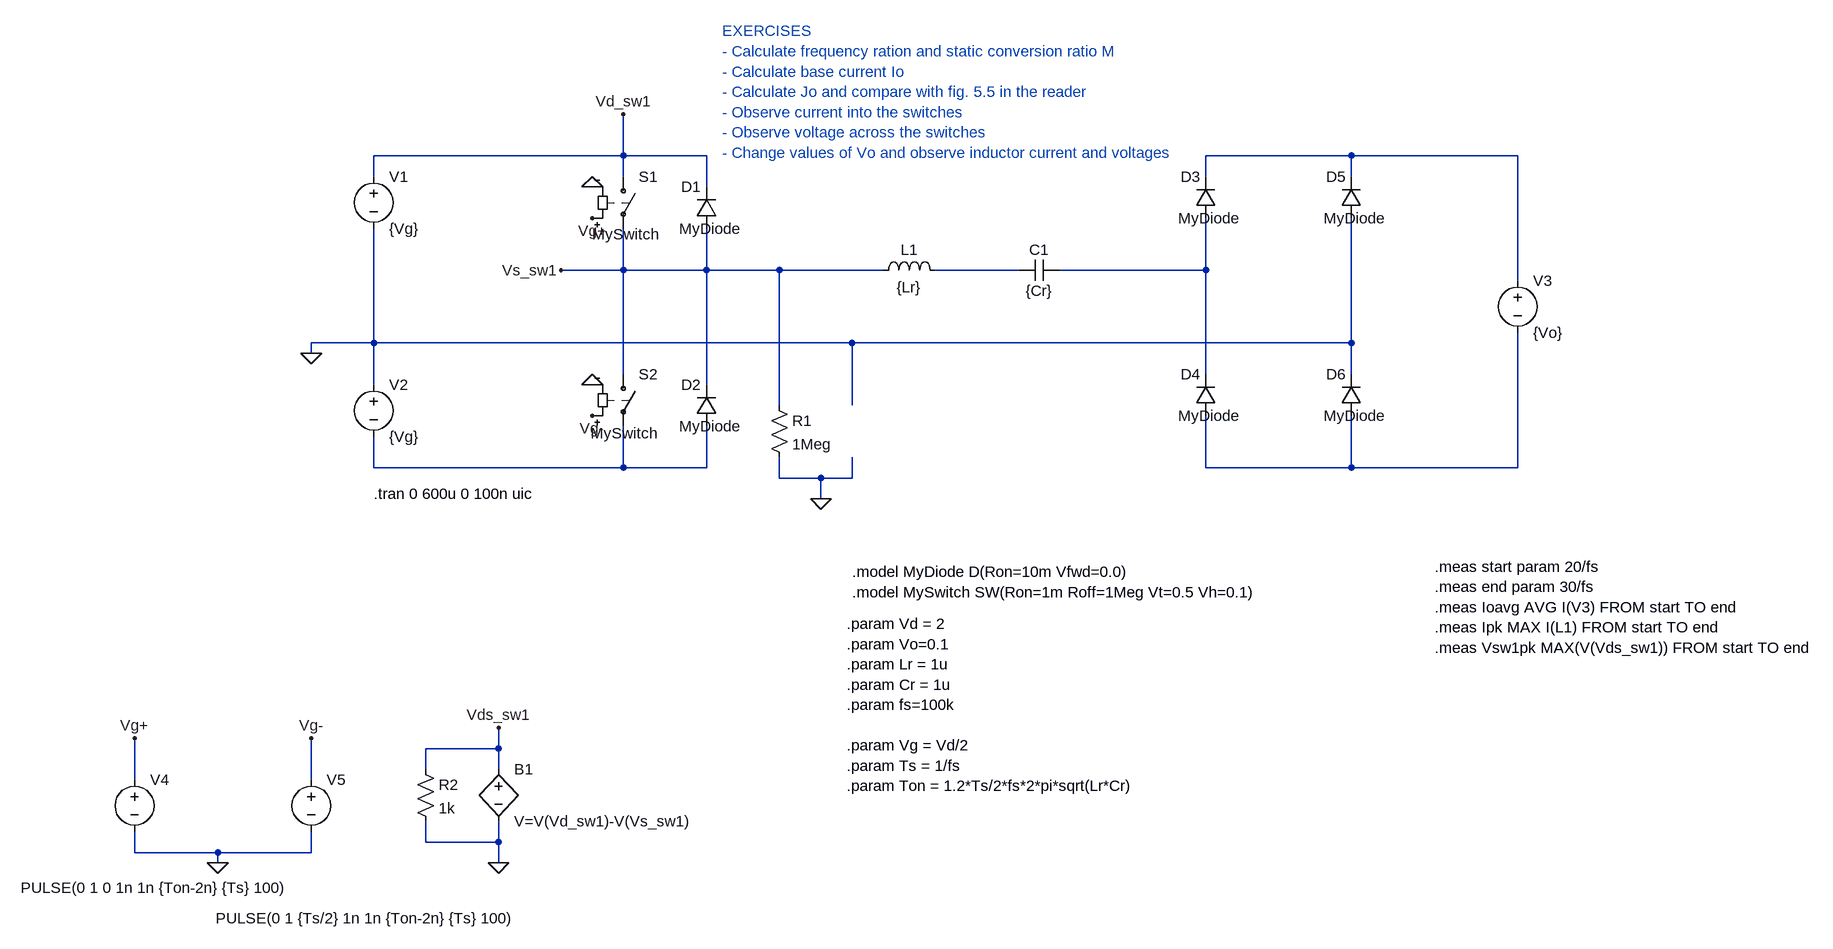
[diagram p0: schematic Series_LC_converter_CCM1.asc]
Series_LC_converter_CCM1.asc, the LTspice schematic file:
Version 4
SHEET 1 2052 1272
WIRE 208 80 208 16
WIRE 208 80 -176 80
WIRE 336 80 208 80
WIRE 1328 80 1104 80
WIRE 1584 80 1328 80
WIRE -176 112 -176 80
WIRE 208 112 208 80
WIRE 1104 112 1104 80
WIRE 1328 112 1328 80
WIRE 336 128 336 80
WIRE 208 256 208 192
WIRE 208 256 112 256
WIRE 336 256 336 192
WIRE 336 256 208 256
WIRE 448 256 336 256
WIRE 608 256 448 256
WIRE 816 256 688 256
WIRE 1104 256 1104 176
WIRE 1104 256 880 256
WIRE 1584 272 1584 80
WIRE -176 368 -176 192
WIRE -176 368 -272 368
WIRE 560 368 -176 368
WIRE 1328 368 1328 176
WIRE 1328 368 560 368
WIRE -272 384 -272 368
WIRE 208 416 208 256
WIRE 1104 416 1104 256
WIRE 1328 416 1328 368
WIRE -176 432 -176 368
WIRE 336 432 336 256
WIRE 448 464 448 256
WIRE 560 464 560 368
WIRE -176 560 -176 512
WIRE 208 560 208 496
WIRE 208 560 -176 560
WIRE 336 560 336 496
WIRE 336 560 208 560
WIRE 1104 560 1104 480
WIRE 1328 560 1328 480
WIRE 1328 560 1104 560
WIRE 1584 560 1584 352
WIRE 1584 560 1328 560
WIRE 448 576 448 544
WIRE 512 576 448 576
WIRE 560 576 560 544
WIRE 560 576 512 576
WIRE 512 608 512 576
WIRE 16 992 16 960
WIRE 16 992 -96 992
WIRE -96 1024 -96 992
WIRE 16 1024 16 992
WIRE -544 1040 -544 976
WIRE -272 1040 -272 976
WIRE -96 1136 -96 1104
WIRE 16 1136 16 1104
WIRE 16 1136 -96 1136
WIRE -544 1152 -544 1120
WIRE -416 1152 -544 1152
WIRE -272 1152 -272 1120
WIRE -272 1152 -416 1152
WIRE -416 1168 -416 1152
WIRE 16 1168 16 1136
FLAG -272 384 0
FLAG -416 1168 0
FLAG -544 976 Vg+
FLAG -272 976 Vg-
FLAG 160 176 Vg+
FLAG 160 480 Vg-
FLAG 160 128 0
FLAG 160 432 0
FLAG 512 608 0
FLAG 208 16 Vd_sw1
FLAG 112 256 Vs_sw1
FLAG 16 1168 0
FLAG 16 960 Vds_sw1
SYMBOL sw 208 96 R0
WINDOW 3 -48 105 Left 2
SYMATTR Value MySwitch
SYMATTR InstName S1
SYMBOL sw 208 400 R0
WINDOW 3 -50 107 Left 2
SYMATTR Value MySwitch
SYMATTR InstName S2
SYMBOL diode 352 192 R180
WINDOW 0 24 64 Left 2
WINDOW 3 -37 0 Left 2
SYMATTR InstName D1
SYMATTR Value MyDiode
SYMBOL voltage -176 96 R0
WINDOW 123 0 0 Left 0
WINDOW 39 0 0 Left 0
SYMATTR InstName V1
SYMATTR Value {Vg}
SYMBOL voltage -176 416 R0
WINDOW 123 0 0 Left 0
WINDOW 39 0 0 Left 0
SYMATTR InstName V2
SYMATTR Value {Vg}
SYMBOL ind 592 272 R270
WINDOW 0 32 56 VTop 2
WINDOW 3 5 56 VBottom 2
SYMATTR InstName L1
SYMATTR Value {Lr}
SYMBOL cap 816 272 R270
WINDOW 0 32 32 VTop 2
WINDOW 3 0 32 VBottom 2
SYMATTR InstName C1
SYMATTR Value {Cr}
SYMBOL voltage 1584 256 R0
WINDOW 123 0 0 Left 0
WINDOW 39 0 0 Left 0
SYMATTR InstName V3
SYMATTR Value {Vo}
SYMBOL voltage -544 1024 R0
WINDOW 3 -175 182 Left 2
WINDOW 123 0 0 Left 0
WINDOW 39 0 0 Left 0
SYMATTR Value PULSE(0 1 0 1n 1n {Ton-2n} {Ts} 100)
SYMATTR InstName V4
SYMBOL voltage -272 1024 R0
WINDOW 3 -147 229 Left 2
WINDOW 123 0 0 Left 0
WINDOW 39 0 0 Left 0
SYMATTR Value PULSE(0 1 {Ts/2} 1n 1n {Ton-2n} {Ts} 100)
SYMATTR InstName V5
SYMBOL diode 352 496 R180
WINDOW 0 24 64 Left 2
WINDOW 3 -37 0 Left 2
SYMATTR InstName D2
SYMATTR Value MyDiode
SYMBOL diode 1120 176 R180
WINDOW 0 24 64 Left 2
WINDOW 3 -37 0 Left 2
SYMATTR InstName D3
SYMATTR Value MyDiode
SYMBOL diode 1120 480 R180
WINDOW 0 24 64 Left 2
WINDOW 3 -37 0 Left 2
SYMATTR InstName D4
SYMATTR Value MyDiode
SYMBOL diode 1344 176 R180
WINDOW 0 24 64 Left 2
WINDOW 3 -37 0 Left 2
SYMATTR InstName D5
SYMATTR Value MyDiode
SYMBOL diode 1344 480 R180
WINDOW 0 24 64 Left 2
WINDOW 3 -37 0 Left 2
SYMATTR InstName D6
SYMATTR Value MyDiode
SYMBOL res 432 448 R0
SYMATTR InstName R1
SYMATTR Value 1Meg
SYMBOL bv 16 1008 R0
SYMATTR InstName B1
SYMATTR Value V=V(Vd_sw1)-V(Vs_sw1)
SYMBOL res -112 1008 R0
SYMATTR InstName R2
SYMATTR Value 1k
TEXT 560 720 Left 2 !.model MyDiode D(Ron=10m Vfwd=0.0)\n.model MySwitch SW(Ron=1m Roff=1Meg Vt=0.5 Vh=0.1)
TEXT 552 800 Left 2 !.param Vd = 2\n.param Vo=0.1\n.param Lr = 1u\n.param Cr = 1u\n.param fs=100k\n \n.param Vg = Vd/2\n.param Ts = 1/fs\n.param Ton = 1.2*Ts/2*fs*2*pi*sqrt(Lr*Cr)
TEXT -176 600 Left 2 !.tran 0 600u 0 100n uic
TEXT 1456 712 Left 2 !.meas start param 20/fs\n.meas end param 30/fs\n.meas Ioavg AVG I(V3) FROM start TO end\n.meas Ipk MAX I(L1) FROM start TO end\n.meas Vsw1pk MAX(V(Vds_sw1)) FROM start TO end
TEXT 360 -112 Left 2 ;EXERCISES\n- Calculate frequency ration and static conversion ratio M\n- Calculate base current Io\n- Calculate Jo and compare with fig. 5.5 in the reader\n- Observe current into the switches\n- Observe voltage across the switches\n- Change values of Vo and observe inductor current and voltages

The netlist it stands for:
* Series_LC_converter_CCM1.asc
S1 Vd_sw1 Vs_sw1 Vg+ 0 MySwitch
S2 Vs_sw1 N004 Vg- 0 MySwitch
D1 Vs_sw1 Vd_sw1 MyDiode
V1 Vd_sw1 0 {Vg}
V2 0 N004 {Vg}
L1 Vs_sw1 N002 {Lr}
C1 N002 N003 {Cr}
V3 N001 N005 {Vo}
V4 Vg+ 0 PULSE(0 1 0 1n 1n {Ton-2n} {Ts} 100)
V5 Vg- 0 PULSE(0 1 {Ts/2} 1n 1n {Ton-2n} {Ts} 100)
D2 N004 Vs_sw1 MyDiode
D3 N003 N001 MyDiode
D4 N005 N003 MyDiode
D5 0 N001 MyDiode
D6 N005 0 MyDiode
R1 Vs_sw1 0 1Meg
B1 Vds_sw1 0 V=V(Vd_sw1)-V(Vs_sw1)
R2 Vds_sw1 0 1k
.model D D
.lib standard.dio
.model MyDiode D(Ron=10m Vfwd=0.0)
.model MySwitch SW(Ron=1m Roff=1Meg Vt=0.5 Vh=0.1)
.param Vd = 2
.param Vo=0.1
.param Lr = 1u
.param Cr = 1u
.param fs=100k
.param Vg = Vd/2
.param Ts = 1/fs
.param Ton = 1.2*Ts/2*fs*2*pi*sqrt(Lr*Cr)
.tran 0 600u 0 100n uic
.meas start param 20/fs
.meas end param 30/fs
.meas Ioavg AVG I(V3) FROM start TO end
.meas Ipk MAX I(L1) FROM start TO end
.meas Vsw1pk MAX(V(Vds_sw1)) FROM start TO end
* EXERCISES
* - Calculate frequency ration and static conversion ratio M
* - Calculate base current Io
* - Calculate Jo and compare with fig. 5.5 in the reader
* - Observe current into the switches
* - Observe voltage across the switches
* - Change values of Vo and observe inductor current and voltages
.backanno
.end